# EAGLE design i2c_expander (EAGLE 5.11)
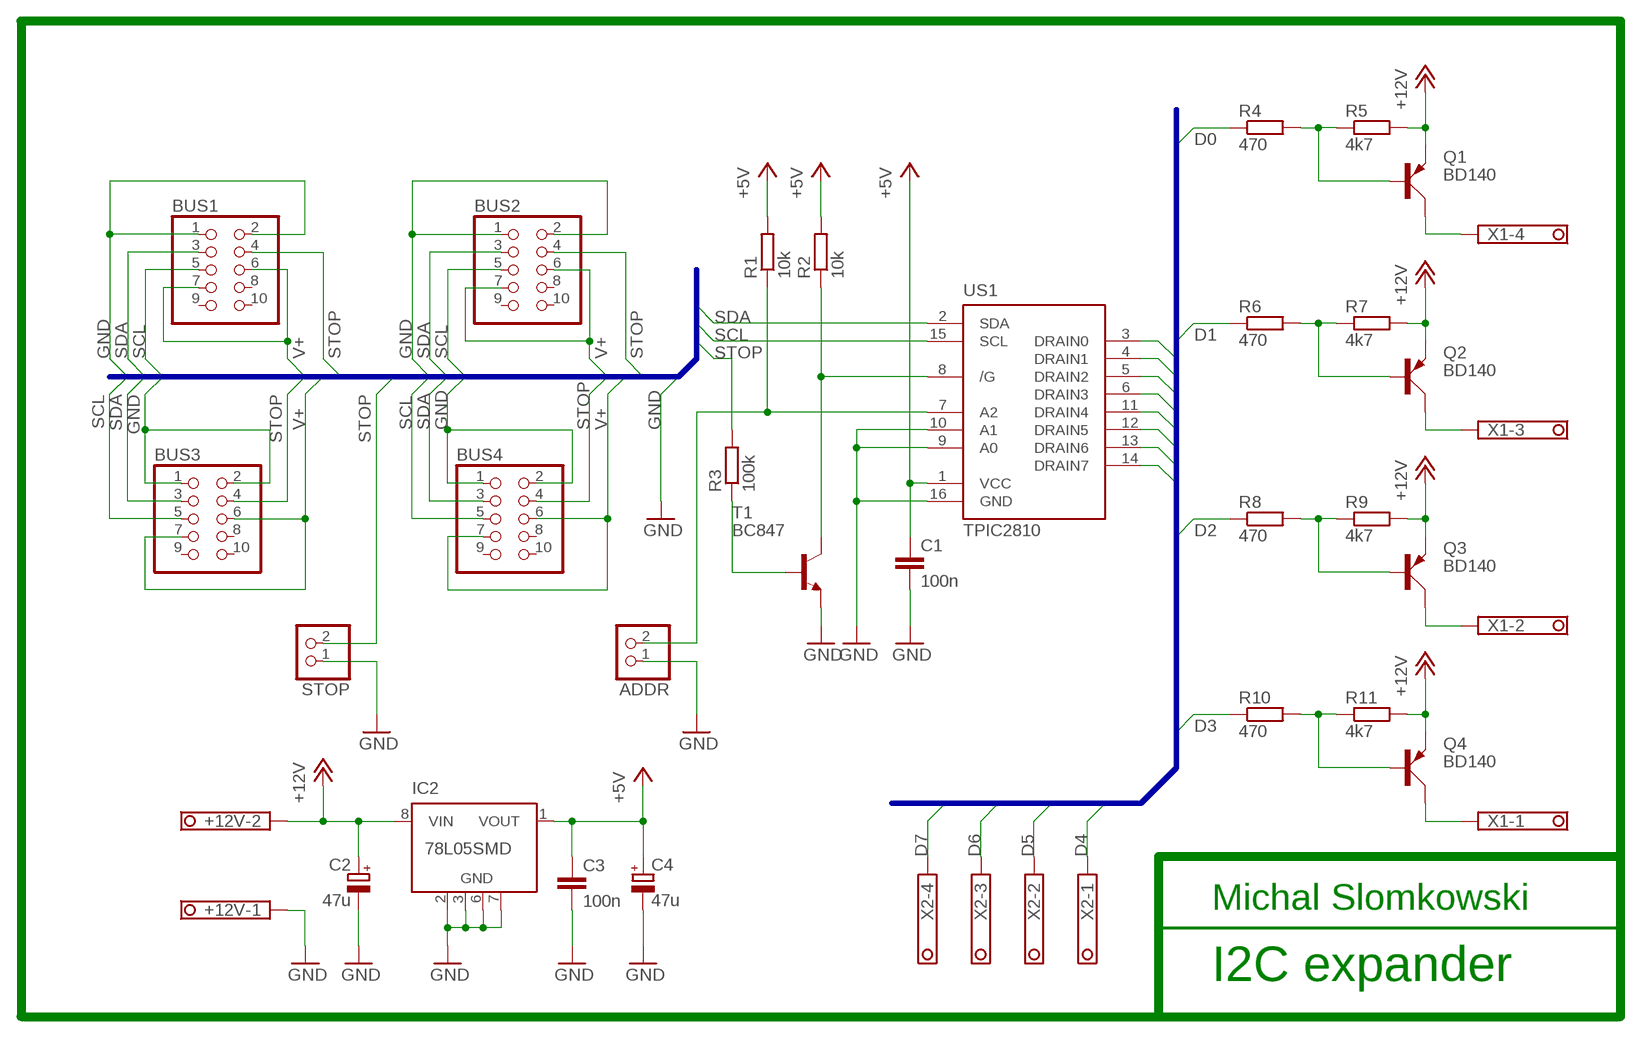
[diagram p0: schematic, sheet 1]

## Parts
+12V  1751248  [1751248]
ADDR  PINHD-1X2  [1X02]
BUS1  PINHD-2X5  [2X05]
BUS2  PINHD-2X5  [2X05]
BUS3  PINHD-2X5  [2X05]
BUS4  PINHD-2X5  [2X05]
C1  100n  C-EUC1206  [C1206]
C2  47u  CPOL-EUE2.5-7  [E2,5-7]
C3  100n  C-EUC1206  [C1206]
C4  47u  CPOL-EUE2.5-7  [E2,5-7]
IC2  78L05SMD  [SO08]
Q1  BD140  [TO126AV]
Q2  BD140  [TO126AV]
Q3  BD140  [TO126AV]
Q4  BD140  [TO126AV]
R1  10k  R-EU_R1206  [R1206]
R2  10k  R-EU_R1206  [R1206]
R3  100k  R-EU_R1206  [R1206]
R4  470  R-EU_R1206  [R1206]
R5  4k7  R-EU_R1206  [R1206]
R6  470  R-EU_R1206  [R1206]
R7  4k7  R-EU_R1206  [R1206]
R8  470  R-EU_R1206  [R1206]
R9  4k7  R-EU_R1206  [R1206]
R10  470  R-EU_R1206  [R1206]
R11  4k7  R-EU_R1206  [R1206]
STOP  PINHD-1X2  [1X02]
T1  BC847  [SOT23]
US1  TPIC2810  [SO16]
X1  1751264  [1751264]
X2  1751264  [1751264]

## Nets
+5V: C1.1 C3.1 C4.+ IC2.1(VOUT) R1.2 R2.2 US1.1(VCC)
+12V: +12V.2 C2.+ IC2.8(VIN) Q1.E Q2.E Q3.E Q4.E R5.2 R7.2 R9.2 R11.2
D0: R4.1 US1.3(DRAIN0)
D1: R6.1 US1.4(DRAIN1)
D2: R8.1 US1.5(DRAIN2)
D3: R10.1 US1.6(DRAIN3)
D4: US1.11(DRAIN4) X2.1
D5: US1.12(DRAIN5) X2.2
D6: US1.13(DRAIN6) X2.3
D7: US1.14(DRAIN7) X2.4
GND: +12V.1 ADDR.1 BUS1.1 BUS1.2 BUS2.1 BUS2.2 BUS3.1 BUS3.2 BUS4.1 BUS4.2 C1.2 C2.- C3.2 C4.- IC2.2(GND) IC2.3(GND) IC2.6(GND) IC2.7(GND) STOP.1 T1.2(E) US1.9(A0) US1.10(A1) US1.16(GND)
N$1: ADDR.2 R1.1 US1.7(A2)
N$2: Q1.B R4.2 R5.1
N$3: R2.1 T1.3(C) US1.8(/G)
N$4: R3.1 T1.1(B)
N$5: Q1.C X1.4
N$6: Q2.B R6.2 R7.1
N$7: Q2.C X1.3
N$8: Q3.B R8.2 R9.1
N$9: Q3.C X1.2
N$10: Q4.B R10.2 R11.1
N$11: Q4.C X1.1
SCL: BUS1.5 BUS2.5 BUS3.5 BUS4.5 US1.15(SCL)
SDA: BUS1.3 BUS2.3 BUS3.3 BUS4.3 US1.2(SDA)
STOP: BUS1.4 BUS2.4 BUS3.4 BUS4.4 R3.2 STOP.2
V+: BUS1.6 BUS1.7 BUS2.6 BUS2.7 BUS3.6 BUS3.7 BUS4.6 BUS4.7
Unconnected: BUS1.8 BUS1.9 BUS1.10 BUS2.8 BUS2.9 BUS2.10 BUS3.8 BUS3.9 BUS3.10 BUS4.8 BUS4.9 BUS4.10 IC2.4(NC) IC2.5(NC)

## Buses
B$1
B$2

## Notes on the sheet
- Michal Slomkowski
- I2C expander

## Library data of the parts
+12V = con-phoenix-350:1751248: MKDS 1/ 2-3,5 Printklemme Nennstrom: 10 A Bemessungsspannung: 160 V Raster: 3,5 mm Polzahl: 2 Montageart: Löten Anschlussart: Schraubanschluss Anschlussrichtung vom Leiter zur Platine: 0° Source: http://eshop.phoenixcontact.com .. 1751248.pdf; OC_FARNELL: unknown; OC_NEWARK: unknown
ADDR STOP = pinhead:PINHD-1X2: PIN HEADER
BUS1-BUS4 = pinhead:PINHD-2X5: PIN HEADER
C1 C3 = rcl:C-EU: CAPACITOR, European symbol
C2 C4 = rcl:CPOL-EU: POLARIZED CAPACITOR, European symbol
IC2 = linear:78L*SMD: Positive VOLTAGE REGULATOR
Q1-Q4 = transistor-power:BD140: PNP TRANSISTOR
R1-R11 = rcl:R-EU_: RESISTOR, European symbol
T1 = transistor:BC847: NPN TRANSISTOR
US1 = robot:TPIC2810: 8-Bit LED Driver with I2C Interface
X1 X2 = con-phoenix-350:1751264: MKDS 1/ 4-3,5 Printklemme Nennstrom: 10 A Bemessungsspannung: 160 V Raster: 3,5 mm Polzahl: 4 Montageart: Löten Anschlussart: Schraubanschluss Anschlussrichtung vom Leiter zur Platine: 0° Source: http://eshop.phoenixcontact.com .. 1751264.pdf; MPN: 1751264; OC_FARNELL: unknown; OC_NEWARK: 10R0934

## Board
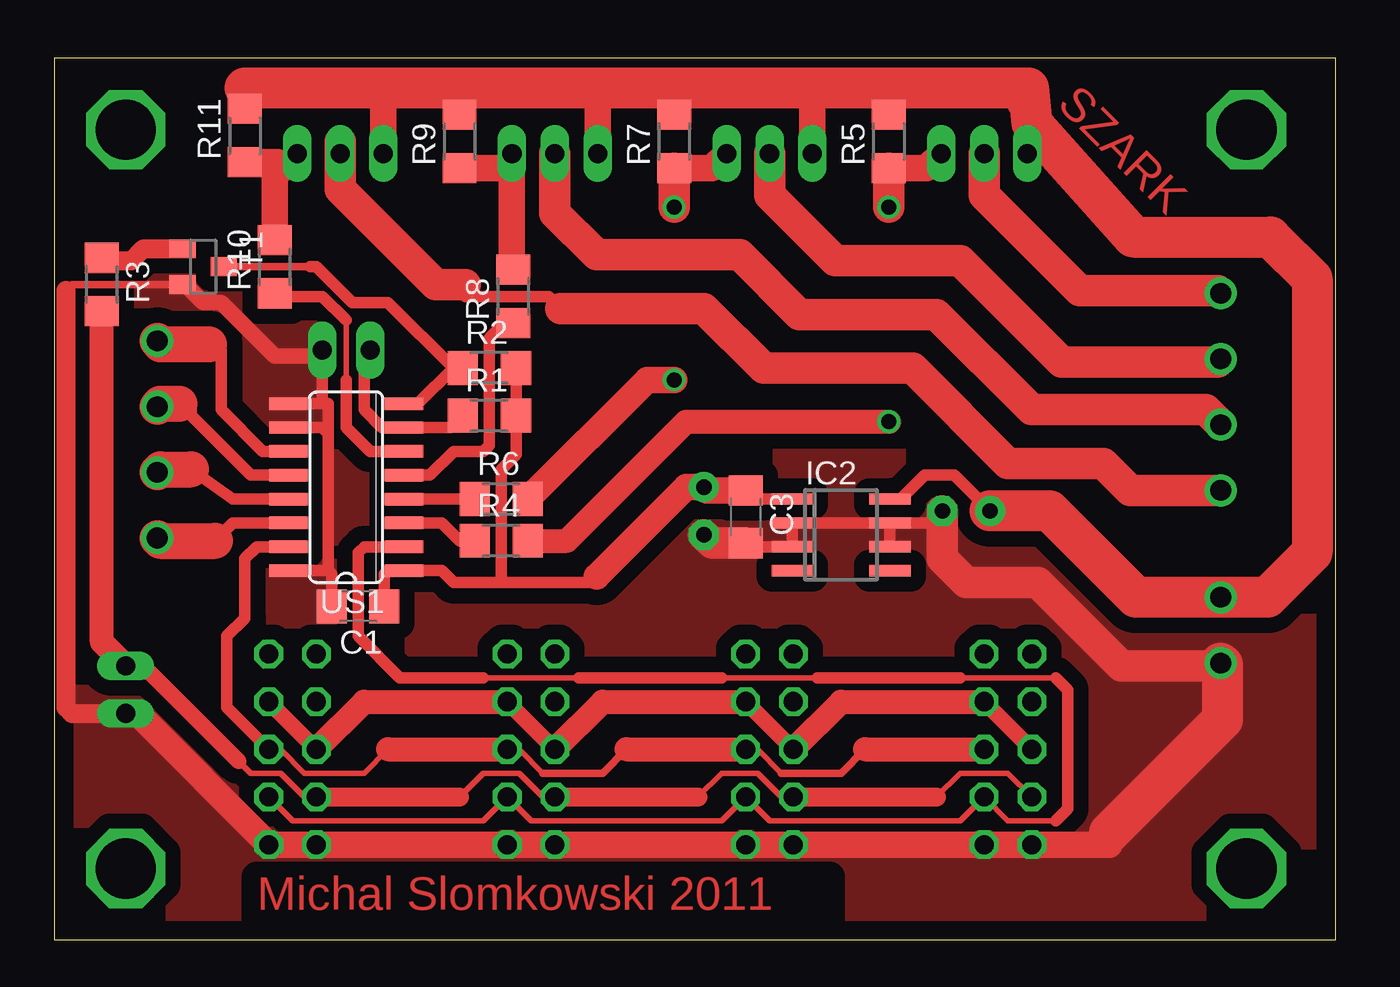
[diagram p1: board, top side]
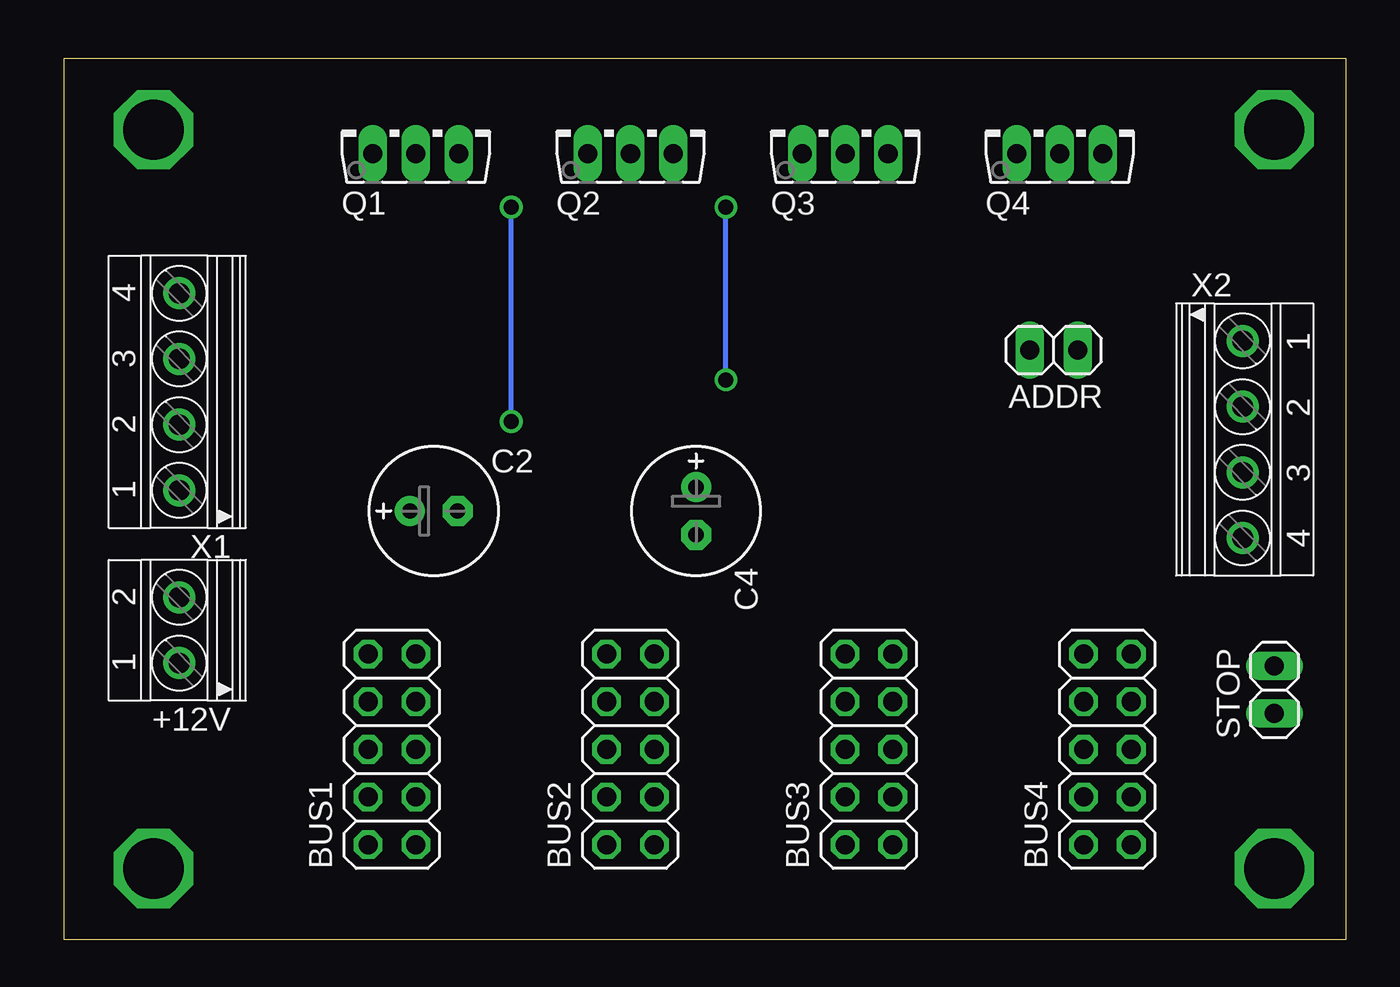
[diagram p2: board, bottom side, seen from below]

Size 68.25 x 46.98 mm. Coordinates in mm from the lower left corner, seen from the top.
Outline: 0,0 68.25,0 68.25,46.98 0,46.98 0,0
Copper layers (1*16): Top 0.035mm / dielectric 1.5mm / Bottom 0.035mm
Design rules "default": minimum track width 10mil, minimum drill 24mil, track to track 8mil, track to pad 8mil, pad to pad 8mil, via to via 8mil, smd to smd 8mil, copper to edge 40mil, drill to drill 8mil, minimum pad ring 10mil, minimum via ring 8mil, stop-mask expansion 4mil, vias tented up to drill 0mil, thermal gap 10mil

### Footprints (pad centres in the part's own frame; a part is rotated, then mirrored left to right if it is on the bottom)
1751248 = drill 1.1 pad 1.7 round: 1 -1.75,-0.1; 2 1.75,-0.1
1X02 = drill 1.016 long: 1 -1.27,0; 2 1.27,0
2X05 = drill 1.016 octagon: 1 -5.08,-1.27; 2 -5.08,1.27; 3 -2.54,-1.27; 4 -2.54,1.27; 5 0,-1.27; 6 0,1.27; 7 2.54,-1.27; 8 2.54,1.27; 9 5.08,-1.27; 10 5.08,1.27
C1206 = smd 1.6 x 1.8: 1 -1.4,0; 2 1.4,0
E2,5-7 = drill 0.813 pad 1.6 round: + -1.27,0 | drill 0.813 pad 1.6 octagon: - 1.27,0
SO08 = smd 0.6 x 2.2: 1 -1.905,-2.6; 2 -0.635,-2.6; 3 0.635,-2.6; 4 1.905,-2.6; 5 1.905,2.6; 6 0.635,2.6; 7 -0.635,2.6; 8 -1.905,2.6
TO126AV = drill 1.016 long: B 2.286,-1.27; C 0,-1.27; E -2.286,-1.27
R1206 = smd 1.6 x 1.803: 1 -1.422,0; 2 1.422,0
SOT23 = smd 1 x 1.4: 1 -0.95,-1.1; 2 0.95,-1.1; 3 0,1.1
SO16 = smd 0.66 x 2.032: 1 -4.445,-3.073; 2 -3.175,-3.073; 3 -1.905,-3.073; 4 -0.635,-3.073; 5 0.635,-3.073; 6 1.905,-3.073; 7 3.175,-3.073; 8 4.445,-3.073; 9 4.445,3.073; 10 3.175,3.073; 11 1.905,3.073; 12 0.635,3.073; 13 -0.635,3.073; 14 -1.905,3.073; 15 -3.175,3.073; 16 -4.445,3.073
1751264 = drill 1.1 pad 1.7 round: 1 -5.25,-0.1; 2 -1.75,-0.1; 3 1.75,-0.1; 4 5.25,-0.1

### Placement (x,y rotation side)
+12V  62.23,16.51 90 bottom
ADDR  15.56,31.43 180 bottom
BUS1  50.8,10.16 90 bottom
BUS2  38.1,10.16 90 bottom
BUS3  25.4,10.16 90 bottom
BUS4  12.7,10.16 90 bottom
C1  16.19,17.78 180 top
C2  48.58,22.86 0 bottom
C3  36.83,22.54 270 top
C4  34.61,22.86 270 bottom
IC2  41.91,21.59 270 top
Q1  49.53,43.18 0 bottom
Q2  38.1,43.18 0 bottom
Q3  26.67,43.18 0 bottom
Q4  15.24,43.18 0 bottom
R1  23.18,27.94 0 top
R2  23.18,30.48 0 top
R3  2.54,34.92 270 top
R4  23.81,21.27 0 top
R5  44.45,42.55 90 top
R6  23.81,23.5 0 top
R7  33.02,42.55 90 top
R8  24.45,34.29 90 top
R9  21.59,42.55 90 top
R10  11.75,35.88 90 top
R11  10.16,42.86 90 top
STOP  3.81,13.34 90 bottom
T1  7.94,35.88 270 top
US1  15.56,24.13 90 top
X1  62.23,29.21 90 bottom
X2  5.4,26.67 270 bottom

### Tracks (layer width: path | path; a pad name or v marks a point on that pad's centre or on a via)
+5V
  Top 0.61: R2.2 R1.2 24.6,25.87 23.81,25.08 23.81,19.05 | 23.81,19.05 21.27,19.05 20.64,19.68 US1.1 17.78,19.68 17.59,19.5 C1.1 | IC2.1 37.28,23.5 C3.1 | 23.81,19.05 28.57,19.05 28.89,19.37
  Top 1.422: C3.1 34.8,23.94 C4.+ 33.66,24.13 28.89,19.37
+12V
  Top 0.61: IC2.8 45.09,23.5 46.35,24.77 47.94,24.77 C2.+
  Top 1.27: 51.75,44.77 51.82,44.7 | 40.32,45.4 40.39,45.34 | 29.21,45.4 28.96,44.7
  Top 1.422: Q4.E 17.53,44.83 18.1,45.4 | 51.75,44.77 51.75,45.4 51.82,44.39 Q1.E | 40.39,45.34 Q2.E | Q3.E 28.96,44.51 29.21,45.4 | 21.59,45.4 R9.2 | 33.02,45.4 R7.2 | 44.77,45.4 R5.2 | R11.2 10.16,45.4
  Top 2.184: 51.82,44.7 51.88,45.4 52.07,43.5 57.47,37.47 64.77,37.47 66.99,35.24 66.99,20.64 64.61,18.26 +12V.2 57.62,18.26 53.02,22.86 C2.+ | 51.75,45.4 44.77,45.4 40.45,45.4 40.39,45.34 | 40.32,45.4 33.02,45.4 29.21,45.4 21.59,45.4 18.1,45.4 10.16,45.4
D0
  Top 0.61: US1.3 20.64,22.23 21.59,21.27 R4.1
D1
  Top 0.61: US1.4 R6.1
D2
  Top 0.61: US1.5 20,24.77 21.27,26.04 22.86,26.04 23.18,26.35 23.18,32.07 24.13,33.02 24.61,33.02 R8.1
D3
  Top 0.305: 15.56,29.84 15.56,33.02
  Top 0.61: US1.6 16.83,26.04 15.56,27.3 15.56,29.84 | 15.56,33.02 14.29,34.29 11.91,34.29 R10.1
D4
  Top 0.61: US1.11 11.11,26.04 8.89,28.26 8.89,31.43 8.26,31.75
  Top 1.93: 8.26,31.75 5.67,31.75 X2.1
D5
  Top 0.61: US1.12 10.48,24.77 7.3,27.94 7.3,28.57 6.67,28.57
  Top 1.93: 6.67,28.57 5.65,28.57 X2.2
D6
  Top 0.61: US1.13 9.53,23.5 7.3,25.08
  Top 1.93: 7.3,25.08 5.66,25.08 X2.3
D7
  Top 0.61: US1.14 9.53,22.23 8.57,21.27
  Top 1.93: 8.57,21.27 5.64,21.27 X2.4
GND
  Top 0.406: T1.2 0.95,34.93 0.64,34.61
  Top 0.61: 14.61,19.68 US1.16 | 14.61,26.99 14.61,19.68 | 14.61,26.99 14.61,28.57 14.29,28.57 | 14.29,28.57 US1.9 | US1.10 14.29,27.3 14.61,26.99 | ADDR.1 14.29,28.57 | C1.2 14.79,19.5 14.61,19.68 | IC2.7 IC2.2 IC2.3 37.02,20.95 C3.2 | IC2.7 IC2.6 | 47.31,22.23 IC2.7
  Top 0.813: T1.2 6.98,34.93 7.94,33.97 8.89,33.97 11.75,31.11 13.97,31.11 ADDR.1
  Top 1.016: STOP.1 0.95,12.06 0.64,12.38 0.64,34.61
  Top 1.422: STOP.1 4.45,12.06 BUS4.1 BUS4.2 BUS3.1 BUS3.2 BUS2.1 BUS2.2 BUS1.1 BUS1.2 56.2,5.08 56.2,5.71
  Top 1.676: C2.- 47.31,22.23 47.31,20.32 48.58,19.05 52.39,19.05 56.83,14.61 61.98,14.61 +12V.1 | C3.2 35.05,21.14 C4.-
  Top 2.184: 56.2,5.71 62.23,11.75 62.23,14.66 +12V.1
  pour Top (isolate 0.813, no thermals): 0.95,45.72 67.31,45.72 67.31,1.27 0.95,1.27
N$1
  Top 0.61: R1.1 21.12,27.3 US1.7 17.46,27.3 16.51,28.26 16.51,31.43 ADDR.2
N$2  (via drill 0.8)
  Top 1.27: v44.45,27.62 33.66,27.62 27.3,21.27 R4.2
  Top 1.422: R5.1 46.46,41.12 Q1.B
  Top 1.676: v44.45,39.05 R5.1
  Bottom 0.254: v44.45,27.62 v44.45,39.05
N$3
  Top 0.406: T1.3 13.65,35.88
  Top 0.61: US1.8 19.37,28.57 21.27,30.48 | 13.65,35.88 13.97,35.88 15.88,33.97 17.78,33.97 21.27,30.48 | 21.27,30.48 R2.1
N$4
  Top 1.016: T1.1 4.76,36.83 4.13,36.2 2.69,36.2 R3.1
N$5
  Top 1.676: Q1.C 49.53,39.69 54.61,34.61 61.98,34.61 X1.4
N$6  (via drill 0.8)
  Top 1.422: v33.02,29.84 31.58,29.84 R6.2 | R7.1 35.03,41.12 Q2.B
  Top 1.676: v33.02,39.05 R7.1
  Bottom 0.254: v33.02,29.84 v33.02,39.05
N$7
  Top 1.676: X1.3 61.97,30.8 53.66,30.8 48.26,36.2 41.59,36.2 38.1,39.69 Q2.C
N$8
  Top 1.422: 24.38,40.96 24.38,35.78 R8.2 | 24.38,40.96 Q3.B | R9.1 24.22,41.12 24.38,40.96
N$9
  Top 1.676: Q3.C 26.67,38.73 28.89,36.51 36.51,36.51 39.69,33.34 46.99,33.34 52.07,28.26 61.33,28.26 X1.2
N$10
  Top 1.422: R10.2 11.75,40.7 12.19,41.15 | 12.19,41.15 Q4.B | R11.1 11.9,41.44 12.19,41.15
N$11
  Top 0.61: 26.99,33.66 26.35,34.29 21.91,34.29 21.91,34.92
  Top 1.676: X1.1 57.32,23.96 55.88,25.4 50.8,25.4 45.72,30.48 37.78,30.48 34.61,33.66 26.99,33.66 | 21.91,34.92 20.32,34.92 15.24,40.01 Q4.C 15.24,42.55
N$13  (via drill 3.2)
  other vias: 3.81,3.81
N$14  (via drill 3.2)
  other vias: 63.5,43.18
N$15  (via drill 3.2)
  other vias: 3.81,43.18
N$16  (via drill 3.2)
  other vias: 63.5,3.81
SCL
  Top 0.305: BUS3.5 24.77,10.16 26.04,8.89 | BUS2.5 37.47,10.16 38.73,8.89 | 17.78,10.16 16.51,8.89 13.34,8.89 12.06,10.16 BUS4.5
  Top 0.406: 26.04,8.89 29.21,8.89 30.48,10.16 | 38.73,8.89 41.91,8.89 43.18,10.16
  Top 0.61: US1.15 10.79,20.95 10.16,20.32 10.16,17.14 9.21,16.19 9.21,12.38 BUS4.5
  Top 1.27: 17.78,10.16 BUS3.5 | 30.48,10.16 BUS2.5 | 43.18,10.16 BUS1.5
SDA
  Top 0.305: BUS4.3 12.7,6.35 22.86,6.35 BUS3.3 25.4,6.35 35.56,6.35 BUS2.3 38.1,6.35 48.26,6.35 BUS1.3 50.8,6.35 53.34,6.35 | 27.94,13.97 22.86,13.97 | 40.64,13.97 35.56,13.97 | 53.34,13.97 48.26,13.97
  Top 0.61: US1.2 16.51,20.95 16.19,20.64 16.19,16.19 18.41,13.97 22.86,13.97 | 35.56,13.97 27.94,13.97 | 48.26,13.97 40.64,13.97 | 53.34,13.97 53.98,13.34 53.98,6.99 53.34,6.35
STOP
  Top 0.305: 21.59,7.62 22.86,8.89 24.77,8.89 26.04,7.62 BUS3.4 | BUS1.4 50.8,8.89 48.26,8.89 46.99,7.62 | 34.29,7.62 35.56,8.89 37.47,8.89 38.73,7.62 BUS2.4 | BUS4.4 13.34,7.62 12.06,8.89 10.48,8.89 9.84,9.53
  Top 0.813: 9.84,9.53 5.08,14.29 4.13,14.29 STOP.2
  Top 1.016: BUS4.4 21.59,7.62 | BUS3.4 34.29,7.62 | BUS2.4 46.99,7.62
  Top 1.27: R3.2 2.54,15.88 STOP.2
V+
  Top 0.813: BUS4.6 BUS4.7 | BUS3.7 BUS3.6 | BUS2.7 BUS2.6 | BUS1.7 BUS1.6
  Top 1.27: BUS1.7 41.91,12.7 BUS2.6 | BUS2.7 29.21,12.7 BUS3.6 | BUS3.7 16.51,12.7 BUS4.6

### Text on the board
Top: SZARK | Michal Slomkowski 2011